# Altium project 屏幕一体板v3.PrjPcb
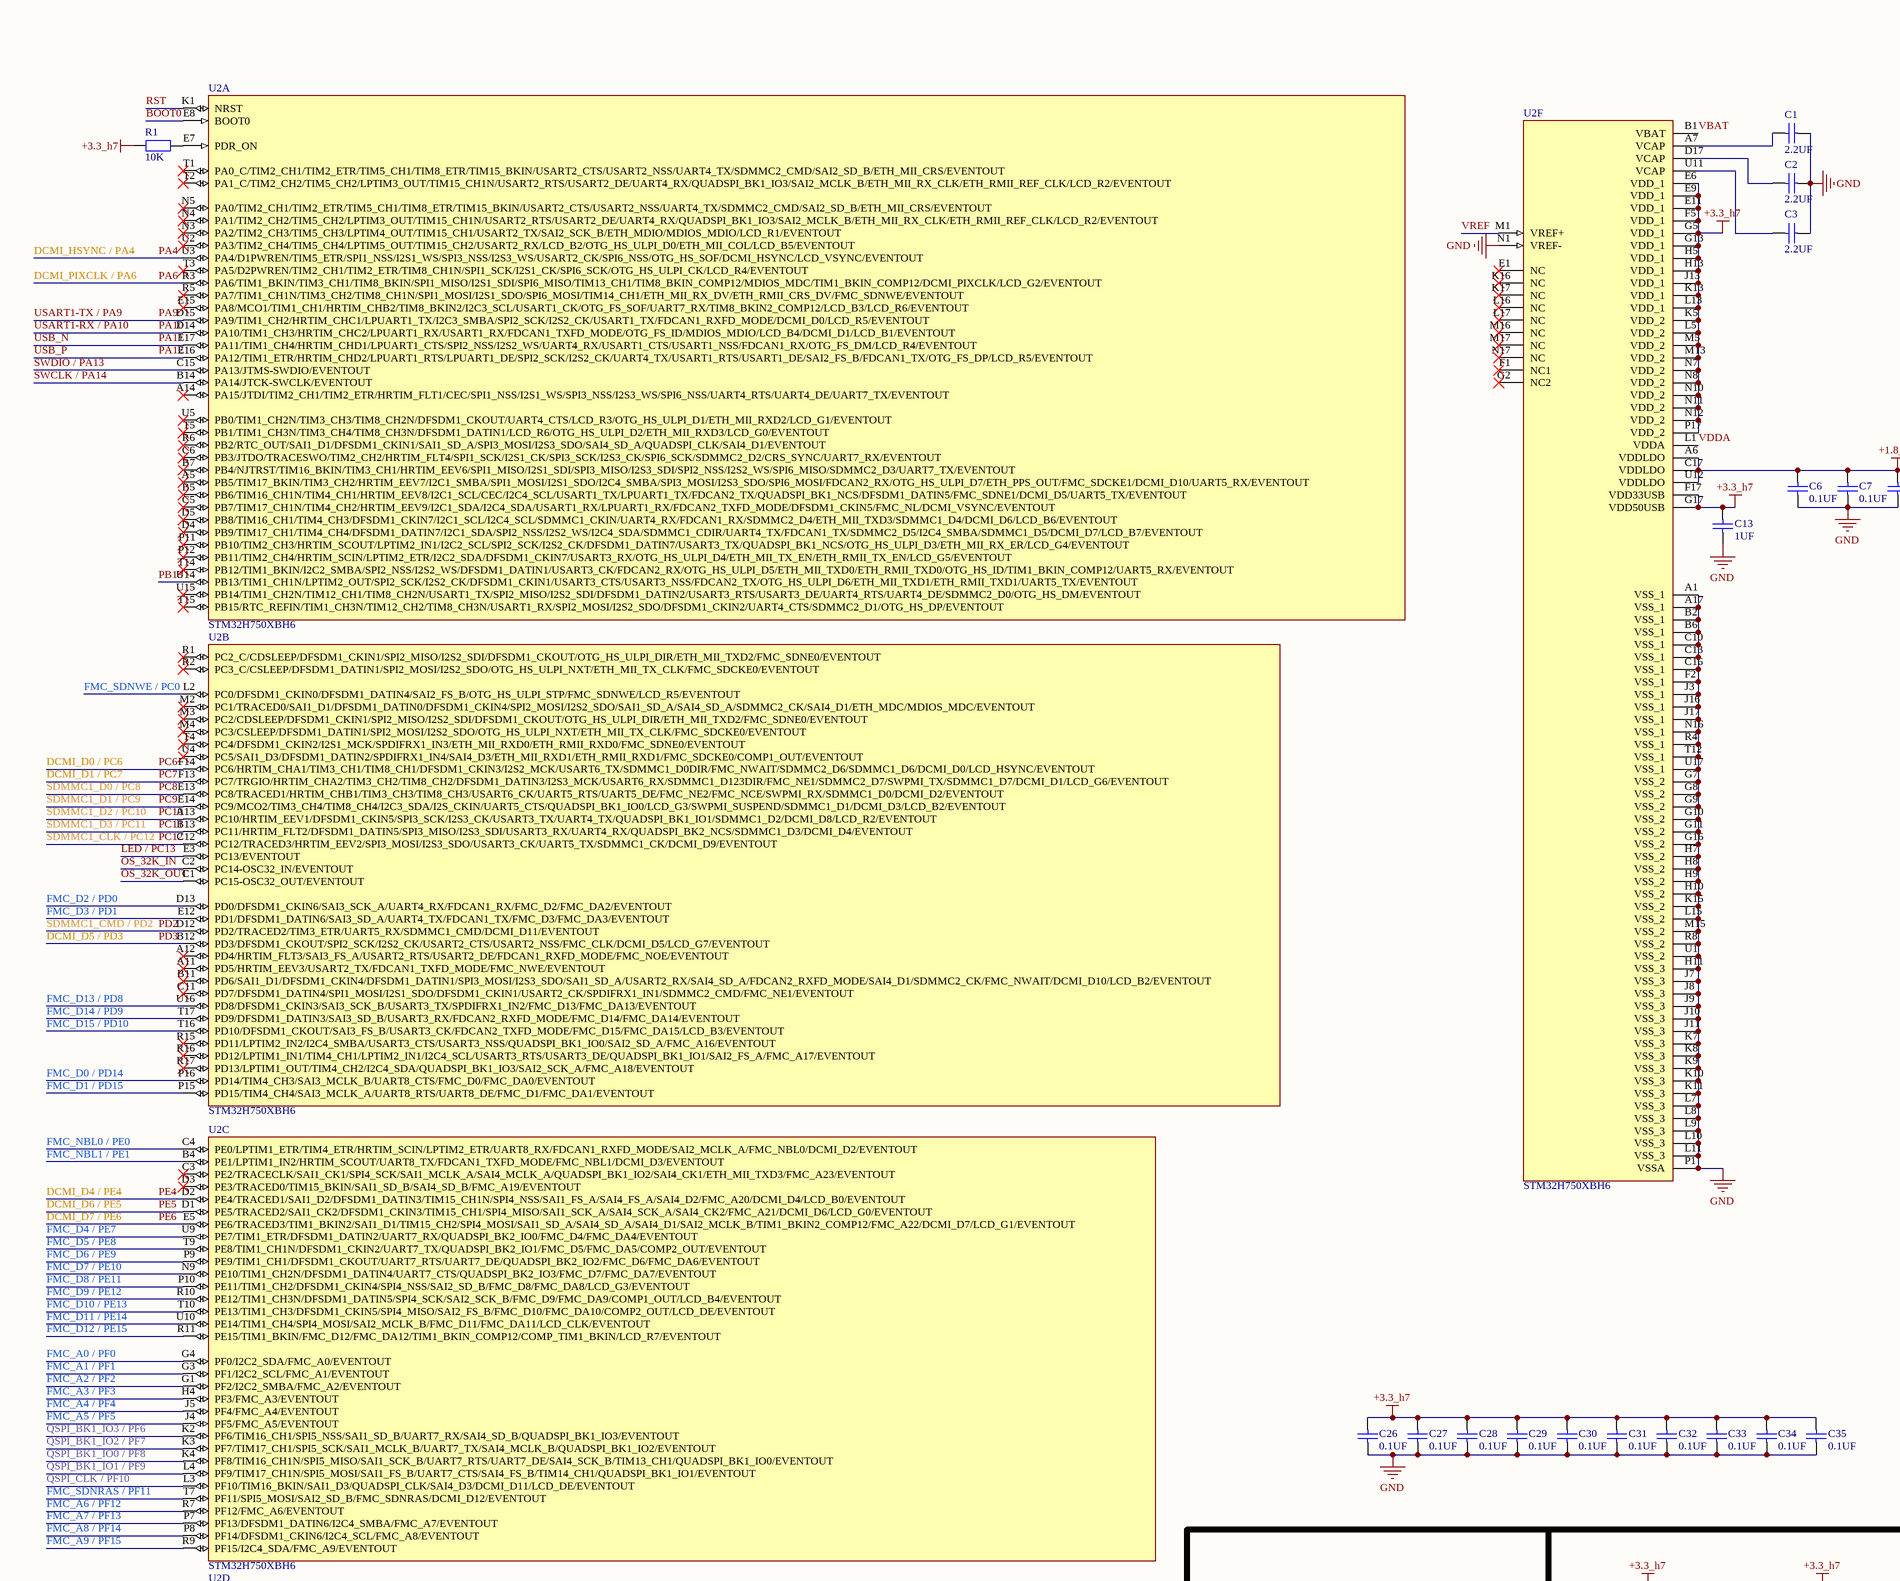
[diagram p0: Sheet1.SchDoc, top left]
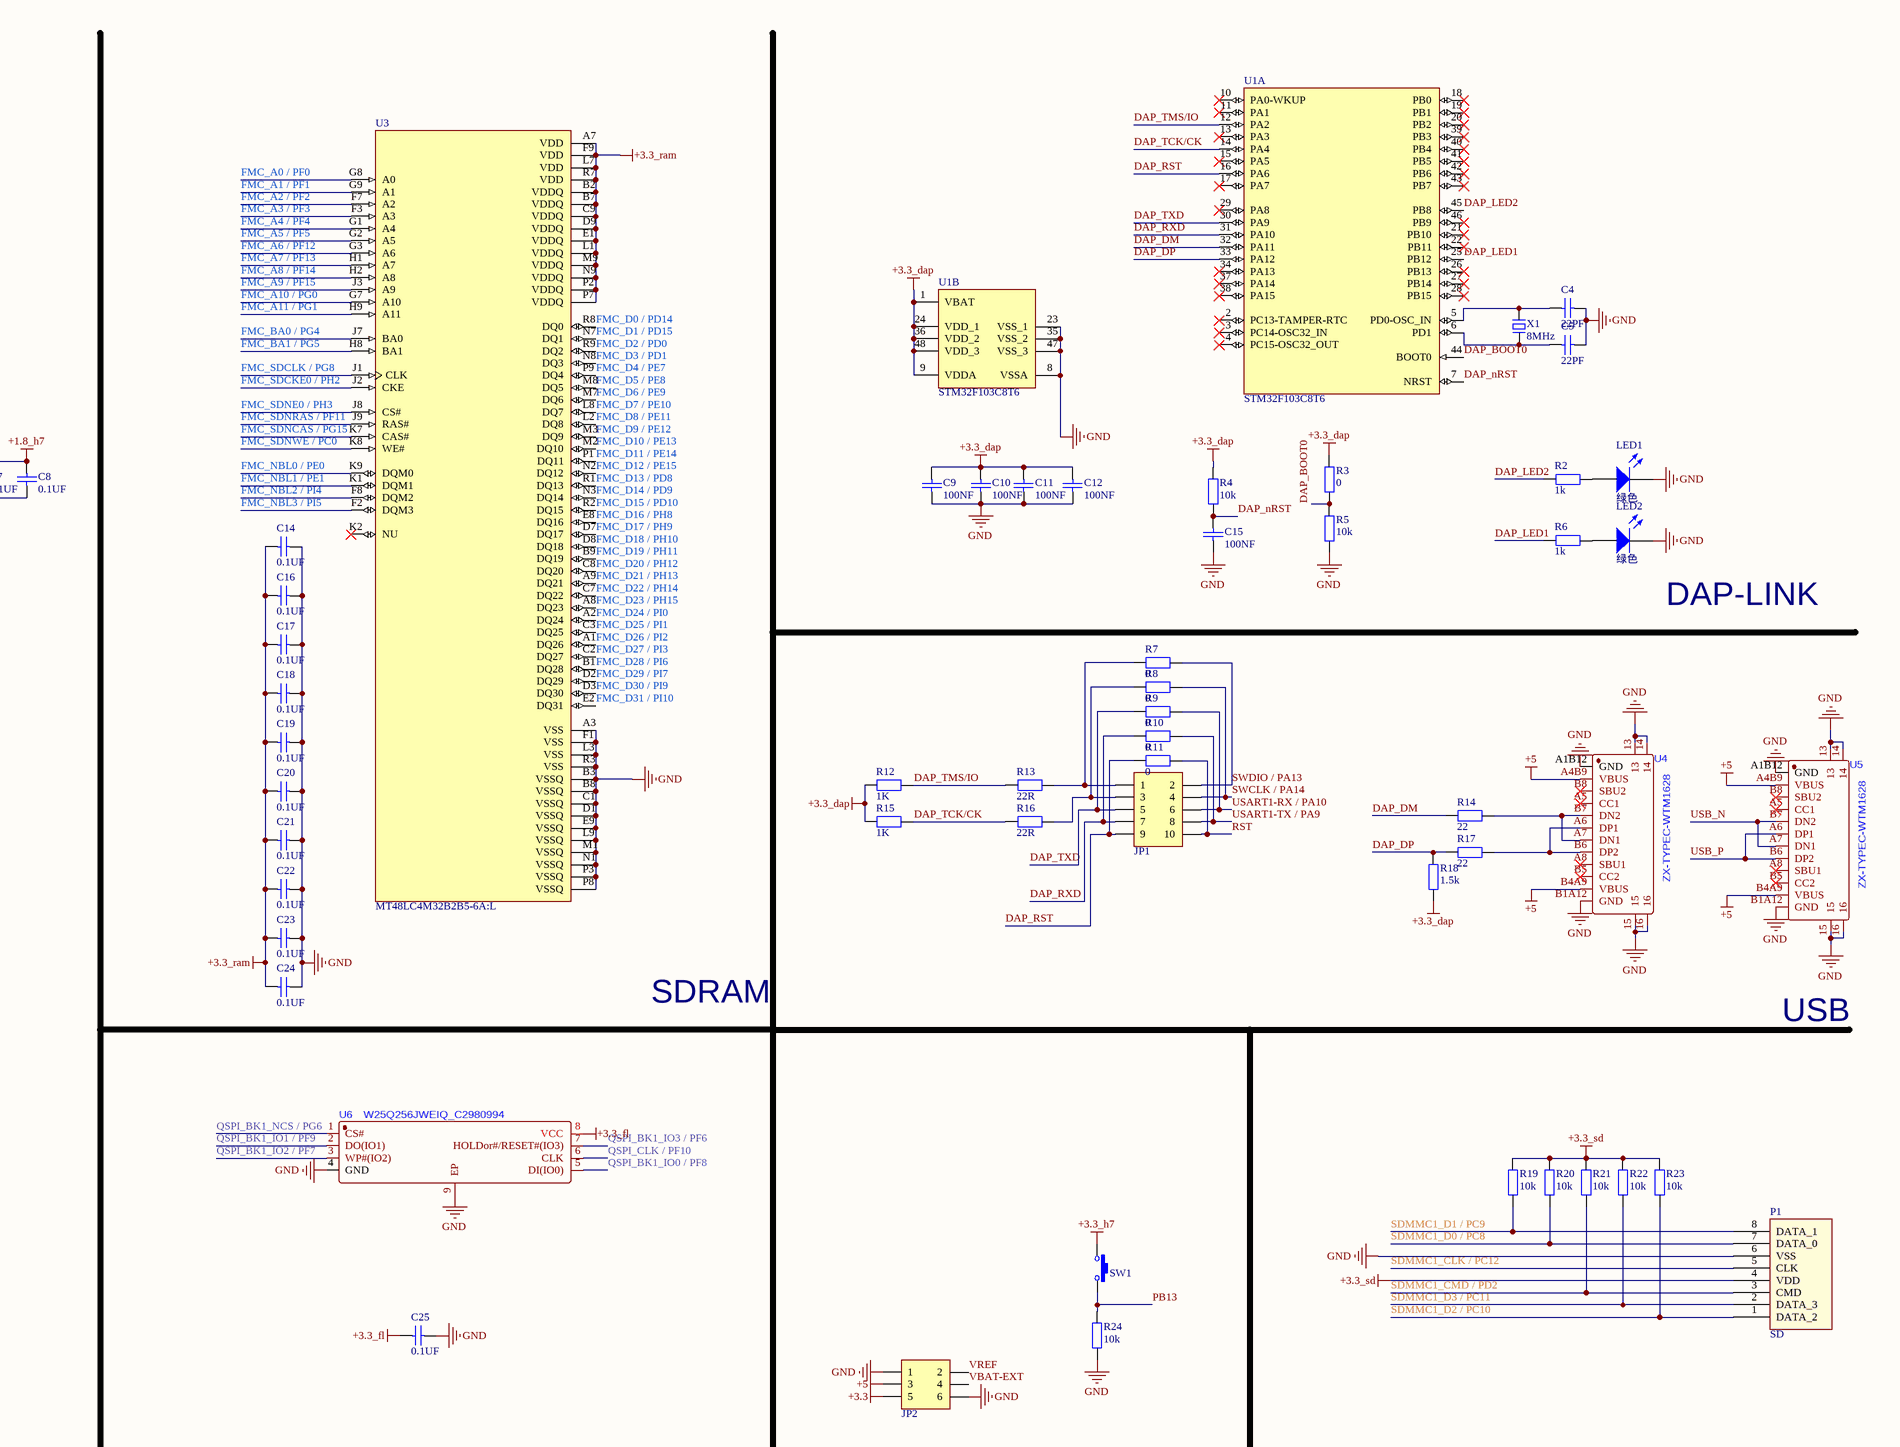
[diagram p1: Sheet1.SchDoc, top right]
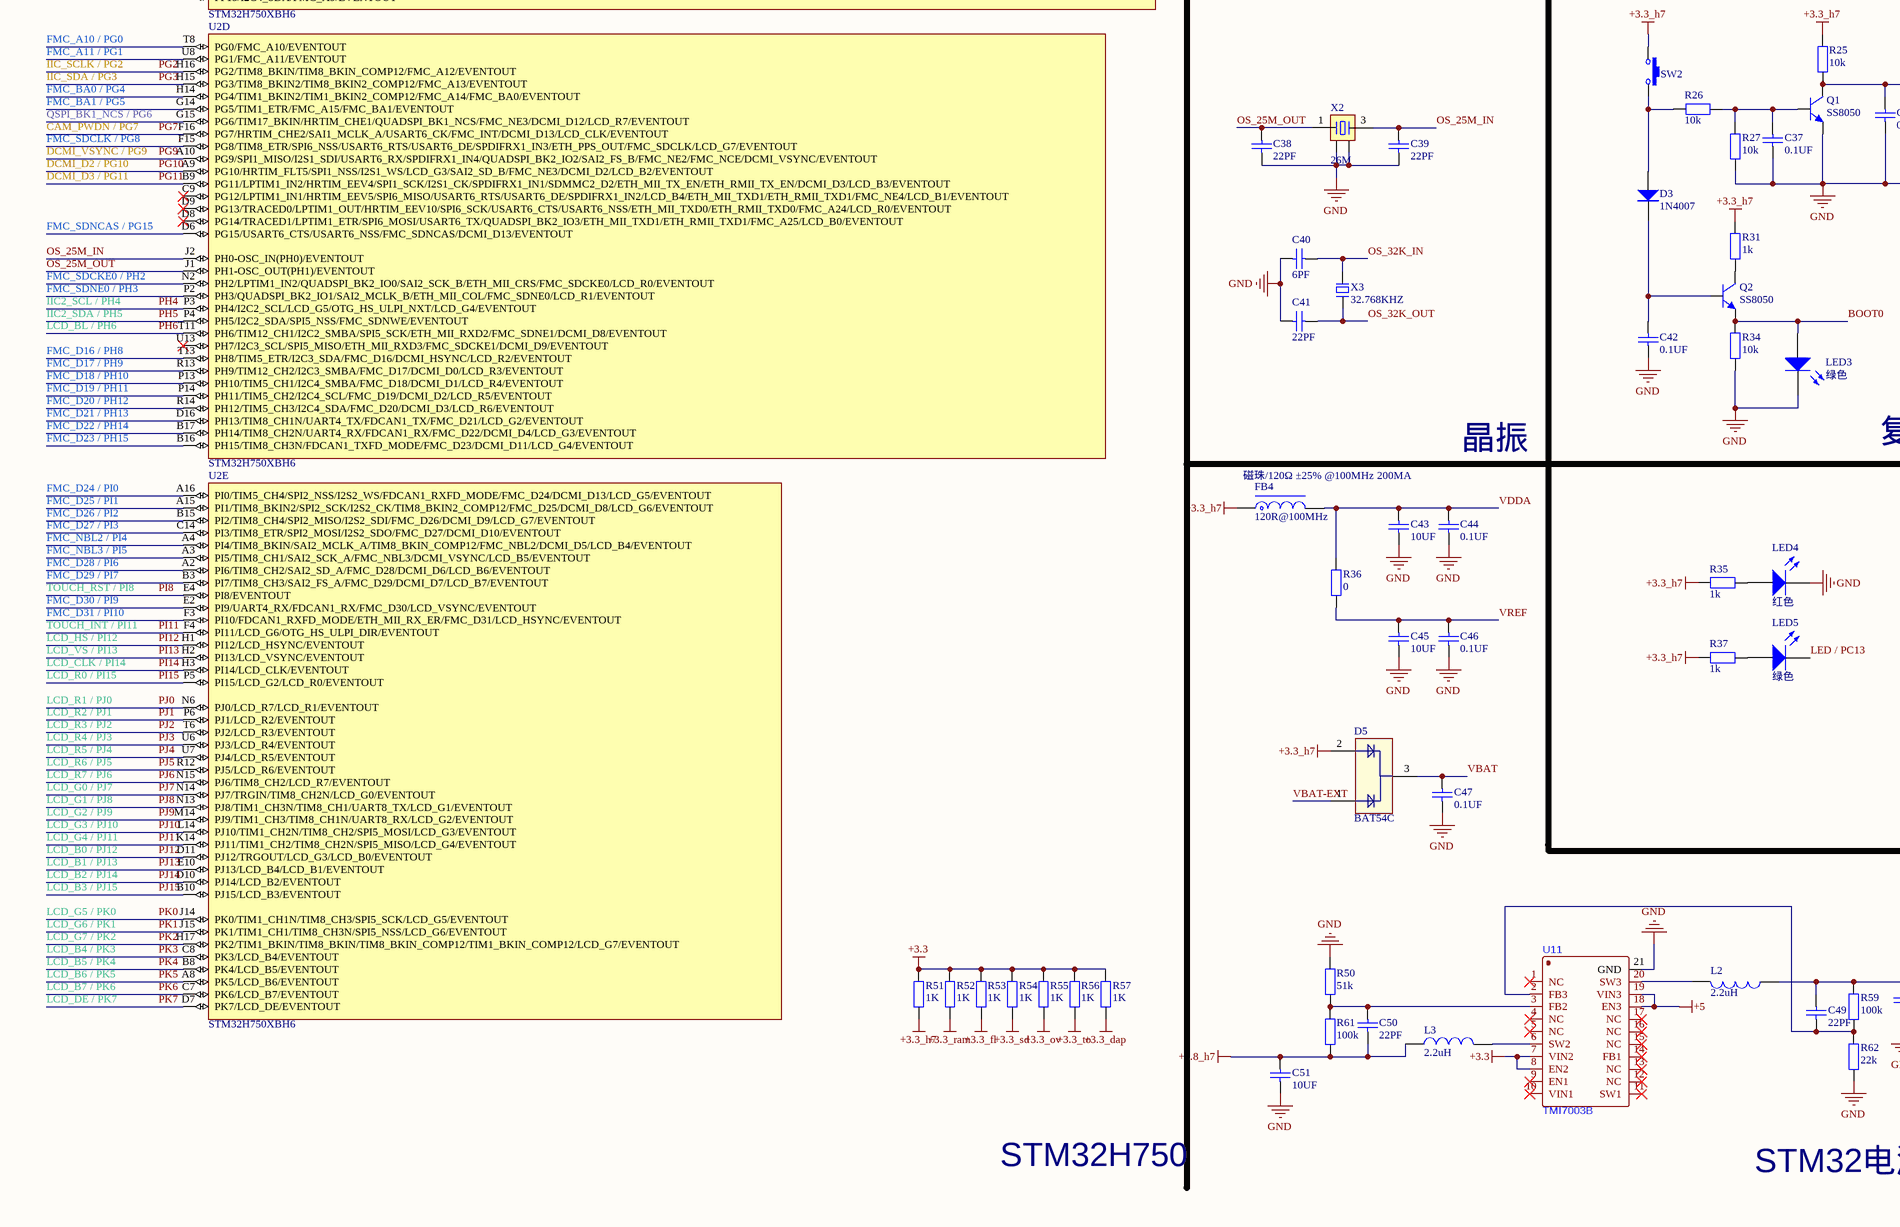
[diagram p2: Sheet1.SchDoc, bottom left]
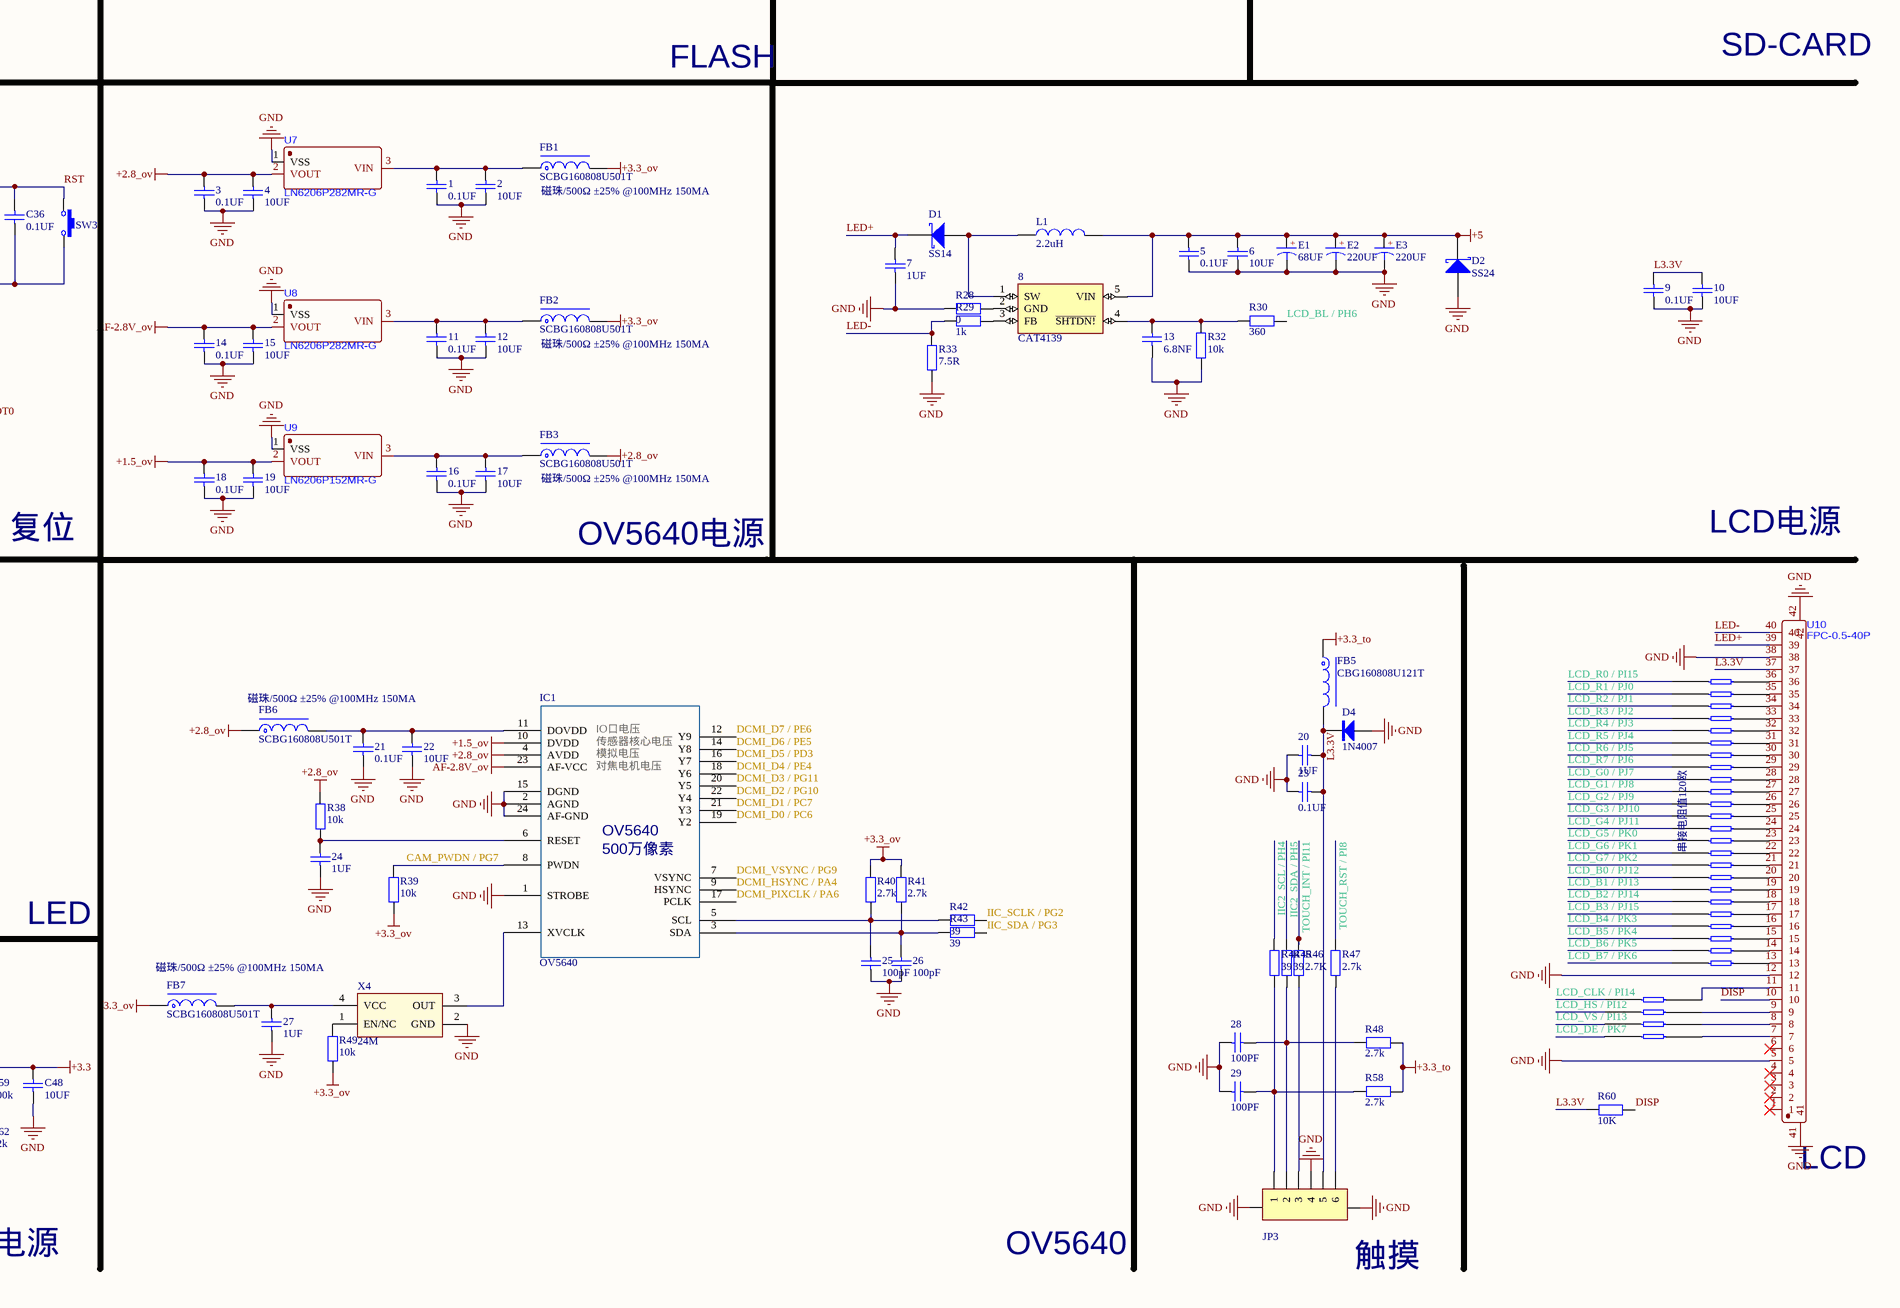
[diagram p3: Sheet1.SchDoc, bottom right]
1 sheet, 197 parts. Net scope: global (net labels, ports and power ports of the same name join across sheets).
Board file: PCB1.PcbDoc

## Sheet Sheet1.SchDoc
size A1; SheetNumber: 1; SheetTotal: 1

### Parts
1  0.1UF  [C0603_L]
2  10UF  [C0603_L]
3  0.1UF  [C0603_L]
4  10UF  [C0603_L]
5  0.1UF  [C0603_L]
6  10UF  [C0603_L]
7  1UF  [C0603_L]
8  CAT4139  [SOT-23(OT)5_LEAD]
9  0.1UF  [C0603_L]
10  10UF  [C0603_L]
11  0.1UF  [C0603_L]
12  10UF  [C0603_L]
13  6.8NF  [C0603_L]
14  0.1UF  [C0603_L]
15  10UF  [C0603_L]
16  0.1UF  [C0603_L]
17  10UF  [C0603_L]
18  0.1UF  [C0603_L]
19  10UF  [C0603_L]
20  1UF  [C0603_L]
21  0.1UF  [C0603_L]
22  10UF  [C0603_L]
23  0.1UF  [C0603_L]
24  1UF  [C0603_L]
25  100pF  [C0603_L]
26  100pF  [C0603_L]
27  1UF  [C0603_L]
28  100PF  [C0603_L]
29  100PF  [C0603_L]
C1  2.2UF  [C0603_L]
C2  2.2UF  [C0603_L]
C3  2.2UF  [C0603_L]
C4  22PF  [C0603_L]
C5  22PF  [C0603_L]
C6  0.1UF  [C0603_L]
C7  0.1UF  [C0603_L]
C8  0.1UF  [C0603_L]
C9  100NF  [C0603_L]
C10  100NF  [C0603_L]
C11  100NF  [C0603_L]
C12  100NF  [C0603_L]
C13  1UF  [C0603_L]
C14  0.1UF  [C0402_M]
C15  100NF  [C0603_L]
C16  0.1UF  [C0402_M]
C17  0.1UF  [C0402_M]
C18  0.1UF  [C0402_M]
C19  0.1UF  [C0402_M]
C20  0.1UF  [C0402_M]
C21  0.1UF  [C0402_M]
C22  0.1UF  [C0402_M]
C23  0.1UF  [C0402_M]
C24  0.1UF  [C0402_M]
C25  0.1UF  [C0603_L]
C26  0.1UF  [C0402_M]
C27  0.1UF  [C0402_M]
C28  0.1UF  [C0603_L]
C29  0.1UF  [C0402_M]
C30  0.1UF  [C0402_M]
C31  0.1UF  [C0402_M]
C32  0.1UF  [C0402_M]
C33  0.1UF  [C0402_M]
C34  0.1UF  [C0402_M]
C35  0.1UF  [C0402_M]
C36  0.1UF  [C0603_L]
C37  0.1UF  [C0603_L]
C38  22PF  [C0603_L]
C39  22PF  [C0603_L]
C40  6PF  [C0603_L]
C41  22PF  [C0603_L]
C42  0.1UF  [C0603_L]
C43  10UF  [C0603_L]
C44  0.1UF  [C0603_L]
C45  10UF  [C0603_L]
C46  0.1UF  [C0603_L]
C47  0.1UF  [C0603_L]
C48  10UF  [C0603_L]
C49  22PF  [C0603_L]
C50  22PF  [C0603_L]
C51  10UF  [C0603_L]
D1  SS14  [SMA]
D2  SS24  [SMA]
D3  1N4007  [SMA]
D4  1N4007  [SMA]
D5  BAT54C  [SOT23-3N]
E1  68UF  [CE A(3*5.4)]
E2  220UF  [CE A(3*5.4)]
E3  220UF  [CE A(3*5.4)]
FB1  SCBG160808U501T  [FB0603]
FB2  SCBG160808U501T  [FB0603]
FB3  SCBG160808U501T  [FB0603]
FB4  120R@100MHz  [FB0603]
FB5  CBG160808U121T  [FB0805]
FB6  SCBG160808U501T  [FB0603]
FB7  SCBG160808U501T  [FB0603]
IC1  OV5640  [OV2640]
JP1  Header 5X2  [HDR2.54-M-LS-2x5P]  (value not drawn)
JP2  Header3X2  [HDR2.54-M-LS-2x3P]  (value not drawn)
JP3  CON-6P  [FPC0.5-WT-6P]  (value not drawn)
L1  2.2uH  [L0805]
L2  2.2uH  [L0805]
L3  2.2uH  [L0805]
LED1  绿色  [LED0805_G]
LED2  绿色  [LED0805_G]
LED3  绿色  [LED0805_G]
LED4  红色  [LED0603_R]
LED5  绿色  [LED0805_G]
P1  SD  [MICRO SD]
Q1  SS8050  [SOT23-3N]
Q2  SS8050  [SOT23-3N]
R1  10K  [R0603_L]
R2  1k  [R0603_L]
R3  0  [R0603_L]
R4  10k  [R0603_L]
R5  10k  [R0603_L]
R6  1k  [R0603_L]
R7  0  [R0603_L]
R8  0  [R0603_L]
R9  0  [R0603_L]
R10  0  [R0603_L]
R11  0  [R0603_L]
R12  1K  [R0805_L]
R13  22R  [R0805_L]
R14  22  [R0603_L]
R15  1K  [R0805_L]
R16  22R  [R0805_L]
R17  22  [R0603_L]
R18  1.5k  [R0603_L]
R19  10k  [R0603_L]
R20  10k  [R0603_L]
R21  10k  [R0603_L]
R22  10k  [R0603_L]
R23  10k  [R0603_L]
R24  10k  [R0603_L]
R25  10k  [R0603_L]
R26  10k  [R0603_L]
R27  10k  [R0603_L]
R28  0  [R0603_L]
R29  1k  [R0603_L]
R30  360  [R0603_L]
R31  1k  [R0603_L]
R32  10k  [R0603_L]
R33  7.5R  [R0603_L]
R34  10k  [R0603_L]
R35  1k  [R0603_L]
R36  0  [R0603_L]
R37  1k  [R0603_L]
R38  10k  [R0603_L]
R39  10k  [R0603_L]
R40  2.7k  [R0603_L]
R41  2.7k  [R0603_L]
R42  39  [R0603_L]
R43  39  [R0603_L]
R44  39  [R0603_L]
R45  39  [R0603_L]
R46  2.7K  [R0603_L]
R47  2.7k  [R0603_L]
R48  2.7k  [R0603_L]
R49  10k  [R0603_L]
R50  51k  [R0603_L]
R51  1K  [R0805_L]
R52  1K  [R0805_L]
R53  1K  [R0805_L]
R54  1K  [R0805_L]
R55  1K  [R0805_L]
R56  1K  [R0805_L]
R57  1K  [R0805_L]
R58  2.7k  [R0603_L]
R59  100k  [R0603_L]
R60  10K  [R0603_L]
R61  100k  [R0603_L]
R62  22k  [R0603_L]
RP1  120R排阻  [0603_4P]  (value not drawn)
RP2  120R排阻  [0603_4P]  (value not drawn)
RP3  120R排阻  [0603_4P]  (value not drawn)
RP4  120R排阻  [0603_4P]  (value not drawn)
RP5  120R排阻  [0603_4P]  (value not drawn)
RP6  120R排阻  [0603_4P]  (value not drawn)
RP7  120R排阻  [0603_4P]  (value not drawn)
SW1  3x6x5  [SW SMD-3*6*2.5]  (value not drawn)
SW2  3x6x5  [SW SMD-3*6*2.5]  (value not drawn)
SW3  3x6x5  [SW SMD-3*6*2.5]  (value not drawn)
U1  STM32F103C8T6  [LQFP48_N]  (parts A,B of 2)
U2  STM32H750XBH6  [IC_STM32H750XBH6]  (parts A,B,C,D,E,F of 6)
U3  MT48LC4M32B2B5-6A:L  [BGA90C80P9X15_800X1300X100N]
U4  ZX-TYPEC-WTM1628  [USB-C-SMD_ZX-TYPEC-WTM1628]
U5  ZX-TYPEC-WTM1628  [USB-C-SMD_ZX-TYPEC-WTM1628]
U6  W25Q256JWEIQ_C2980994  [WSON-8_L8.0-W6.0-P1.27-TL-EP-1]
U7  LN6206P282MR-G  [SOT-23-3_L2.9-W1.3-P1.90-LS2.4-BR]
U8  LN6206P282MR-G  [SOT-23-3_L2.9-W1.3-P1.90-LS2.4-BR]
U9  LN6206P152MR-G  [SOT-23-3_L2.9-W1.3-P1.90-LS2.4-BR]
U10  FPC-0.5-40P  [CONN-SMD_FPC-0.5-40P]
U11  TMI7003B  [QFN-20_L3.0-W3.0-P0.40-BL-EP1.7]
X1  8MHz  [XTAL-3215-2P]
X2  26M  [XTAL-3225-4P]
X3  32.768KHZ  [XTAL-3215-2P]
X4  24M  [OSC-3225-4P]

### Nets
+1.5_ov: 18.2 19.2 IC1.10(DVDD) U9.2(VOUT)
+1.8_h7: C6.1 C7.1 C8.1 C50.2 C51.1 L3.1 R61.1 U2.A6(VDDLDO) U2.C17(VDDLDO) U2.U12(VDDLDO)
+2.8_ov: 3.2 4.2 FB3.2 FB6.1 IC1.4(AVDD) R38.1 U7.2(VOUT)
+3.3: C48.2 C49.2 JP2.5 L2.1 R51.2 R52.2 R53.2 R54.2 R55.2 R56.2 R57.2 R59.1 U11.7(VIN2) U11.8(EN2)
+3.3_dap: C9.2 C10.2 C11.2 C12.2 R3.2 R4.2 R12.1 R15.1 R18.1 R57.1 U1.1(VBAT) U1.9(VDDA) U1.24(VDD_1) U1.36(VDD_2) U1.48(VDD_3)
+3.3_fl: C25.2 R53.1 U6.8(VCC)
+3.3_h7: C13.2 C26.2 C27.2 C28.2 C29.2 C30.2 C31.2 C32.2 C33.2 C34.2 C35.2 D5.2 FB4.1 R1.1 R25.2 R31.2 R35.1 R37.1 R51.1 SW1.1 SW2.1 U2.E6(VDD_1) U2.E9(VDD_1) U2.E11(VDD_1) U2.F5(VDD_1) U2.F17(VDD33USB) U2.G5(VDD_1) U2.G13(VDD_1) U2.G17(VDD50USB) U2.H5(VDD_1) U2.H13(VDD_1) U2.J13(VDD_1) U2.K5(VDD_2) U2.K13(VDD_1) U2.L5(VDD_2) U2.L13(VDD_1) U2.M5(VDD_2) U2.M13(VDD_2) U2.N7(VDD_2) U2.N8(VDD_2) U2.N10(VDD_2) U2.N11(VDD_2) U2.N12(VDD_2) U2.P17(VDD_2)
+3.3_ov: FB1.2 FB2.2 FB7.1 R39.2 R40.2 R41.2 R49.2 R55.1
+3.3_ram: C14.2 C16.2 C17.2 C18.2 C19.2 C20.2 C21.2 C22.2 C23.2 C24.2 R52.1 U3.A7(VDD) U3.B2(VDDQ) U3.B7(VDDQ) U3.C9(VDDQ) U3.D9(VDDQ) U3.E1(VDDQ) U3.F9(VDD) U3.L1(VDDQ) U3.L7(VDD) U3.M9(VDDQ) U3.N9(VDDQ) U3.P2(VDDQ) U3.P7(VDDQ) U3.R7(VDD)
+3.3_sd: P1.4(VDD) R19.1 R20.1 R21.1 R22.1 R23.1 R54.1
+3.3_to: FB5.1 R48.2 R56.1 R58.2
+5: 5.2 6.2 8.5(VIN) D2.2(K) E1.1 E2.1 E3.1 JP2.3 L1.2 U4.A4B9(VBUS) U4.B4A9(VBUS) U5.A4B9(VBUS) U5.B4A9(VBUS) U11.18(EN3) U11.19(VIN3)
AF-2.8V_ov: 14.2 15.2 IC1.23(AF-VCC) U8.2(VOUT)
GND: 1.1 2.1 3.1 4.1 5.1 6.1 7.1 9.1 10.1 11.1 12.1 13.1 14.1 15.1 16.1 17.1 18.1 19.1 20.1 21.1 22.1 23.1 24.1 25.1 26.1 27.1 28.1 29.1 C1.1 C2.1 C3.1 C4.2 C5.2 C6.2 C7.2 C8.2 C9.1 C10.1 C11.1 C12.1 C13.1 C14.1 C15.1 C16.1 C17.1 C18.1 C19.1 C20.1 C21.1 C22.1 C23.1 C24.1 C25.1 C26.1 C27.1 C28.1 C29.1 C30.1 C31.1 C32.1 C33.1 C34.1 C35.1 C36.2 C37.2 C38.1 C39.1 C40.2 C41.2 C42.2 C43.1 C44.1 C45.1 C46.1 C47.2 C48.1 C51.2 D2.1(A) D4.1(A) E1.2 E2.2 E3.2 IC1.1(STROBE) IC1.2(AGND) IC1.15(DGND) IC1.24(AF-GND) JP2.1 JP2.6 JP3.0 JP3.4 LED1.2(K) LED2.2(K) LED3.2(K) LED4.2(K) P1.6(VSS) Q1.2(E) R5.1 R24.1 R27.1 R28.1 R32.2 R33.2 R34.1 R50.2 R62.2 SW3.2 U1.8(VSSA) U1.23(VSS_1) U1.35(VSS_2) U1.47(VSS_3) U2.A1(VSS_1) U2.A17(VSS_1) U2.B2(VSS_1) U2.B6(VSS_1) U2.C10(VSS_1) U2.C13(VSS_1) U2.C16(VSS_1) U2.F2(VSS_1) U2.G7(VSS_2) U2.G8(VSS_2) U2.G9(VSS_2) U2.G10(VSS_2) U2.G11(VSS_2) U2.G16(VSS_2) U2.H7(VSS_2) U2.H8(VSS_2) U2.H9(VSS_2) U2.H10(VSS_2) U2.H11(VSS_3) U2.J3(VSS_1) U2.J7(VSS_3) U2.J8(VSS_3) U2.J9(VSS_3) U2.J10(VSS_3) U2.J11(VSS_3) U2.J16(VSS_1) U2.J17(VSS_1) U2.K7(VSS_3) U2.K8(VSS_3) U2.K9(VSS_3) U2.K10(VSS_3) U2.K11(VSS_3) U2.K15(VSS_2) U2.L7(VSS_3) U2.L8(VSS_3) U2.L9(VSS_3) U2.L10(VSS_3) U2.L11(VSS_3) U2.L15(VSS_2) U2.M15(VSS_2) U2.N1(VREF-) U2.N16(VSS_1) U2.P1(VSSA) U2.R4(VSS_1) U2.R8(VSS_2) U2.T12(VSS_1) U2.U1(VSS_2) U2.U17(VSS_1) U3.A3(VSS) U3.B3(VSSQ) U3.B8(VSSQ) U3.C1(VSSQ) U3.D1(VSSQ) U3.E9(VSSQ) U3.F1(VSS) U3.L3(VSS) U3.L9(VSSQ) U3.M1(VSSQ) U3.N1(VSSQ) U3.P3(VSSQ) U3.P8(VSSQ) U3.R3(VSS) U4.13 U4.14 U4.15 U4.16 U4.A1B12(GND) U4.B1A12(GND) U5.13 U5.14 U5.15 U5.16 U5.A1B12(GND) U5.B1A12(GND) U6.4(GND) U6.9(EP) U7.1(VSS) U8.1(VSS) U9.1(VSS) U10.5 U10.12 U10.38 U10.41 U10.42 U11.21(GND) X2.2 X2.4 X4.2(GND)
BOOT0: LED3.1(A) Q2.2(E) R34.2 U2.E8(BOOT0)
CAM_PWDN / PG7: IC1.8(PWDN) R39.1 U2.F16(PG7/HRTIM_CHE2/SAI1_MCLK_A/USART6_CK/FMC_INT/DCMI_D13/LCD_CLK/EVENTOUT)  [also labelled PG7]
DAP_BOOT0: R3.1 R5.2 U1.44(BOOT0)
DAP_DM: R14.1 U1.32(PA11)
DAP_DP: R17.1 R18.2 U1.33(PA12)
DAP_LED1: R6.1 U1.25(PB12)
DAP_LED2: R2.1 U1.45(PB8)
DAP_nRST: C15.2 R4.1 U1.7(NRST)
DAP_RST: JP1.9 R11.1 U1.16(PA6)
DAP_RXD: JP1.7 R10.1 U1.31(PA10)
DAP_TCK/CK: R15.2 R16.1 U1.14(PA4)
DAP_TMS/IO: R12.2 R13.1 U1.12(PA2)
DAP_TXD: JP1.5 R9.1 U1.30(PA9)
DCMI_D0 / PC6: IC1.19(Y2) U2.F14(PC6/HRTIM_CHA1/TIM3_CH1/TIM8_CH1/DFSDM1_CKIN3/I2S2_MCK/USART6_TX/SDMMC1_D0DIR/FMC_NWAIT/SDMMC2_D6/SDMMC1_D6/DCMI_D0/LCD_HSYNC/EVENTOUT)  [also labelled PC6]
DCMI_D1 / PC7: IC1.21(Y3) U2.F13(PC7/TRGIO/HRTIM_CHA2/TIM3_CH2/TIM8_CH2/DFSDM1_DATIN3/I2S3_MCK/USART6_RX/SDMMC1_D123DIR/FMC_NE1/SDMMC2_D7/SWPMI_TX/SDMMC1_D7/DCMI_D1/LCD_G6/EVENTOUT)  [also labelled PC7]
DCMI_D2 / PG10: IC1.22(Y4) U2.A9(PG10/HRTIM_FLT5/SPI1_NSS/I2S1_WS/LCD_G3/SAI2_SD_B/FMC_NE3/DCMI_D2/LCD_B2/EVENTOUT)  [also labelled PG10]
DCMI_D3 / PG11: IC1.20(Y5) U2.B9(PG11/LPTIM1_IN2/HRTIM_EEV4/SPI1_SCK/I2S1_CK/SPDIFRX1_IN1/SDMMC2_D2/ETH_MII_TX_EN/ETH_RMII_TX_EN/DCMI_D3/LCD_B3/EVENTOUT)  [also labelled PG11]
DCMI_D4 / PE4: IC1.18(Y6) U2.D2(PE4/TRACED1/SAI1_D2/DFSDM1_DATIN3/TIM15_CH1N/SPI4_NSS/SAI1_FS_A/SAI4_FS_A/SAI4_D2/FMC_A20/DCMI_D4/LCD_B0/EVENTOUT)  [also labelled PE4]
DCMI_D5 / PD3: IC1.16(Y7) U2.B12(PD3/DFSDM1_CKOUT/SPI2_SCK/I2S2_CK/USART2_CTS/USART2_NSS/FMC_CLK/DCMI_D5/LCD_G7/EVENTOUT)  [also labelled PD3]
DCMI_D6 / PE5: IC1.14(Y8) U2.D1(PE5/TRACED2/SAI1_CK2/DFSDM1_CKIN3/TIM15_CH1/SPI4_MISO/SAI1_SCK_A/SAI4_SCK_A/SAI4_CK2/FMC_A21/DCMI_D6/LCD_G0/EVENTOUT)  [also labelled PE5]
DCMI_D7 / PE6: IC1.12(Y9) U2.E5(PE6/TRACED3/TIM1_BKIN2/SAI1_D1/TIM15_CH2/SPI4_MOSI/SAI1_SD_A/SAI4_SD_A/SAI4_D1/SAI2_MCLK_B/TIM1_BKIN2_COMP12/FMC_A22/DCMI_D7/LCD_G1/EVENTOUT)  [also labelled PE6]
DCMI_HSYNC / PA4: IC1.9(HSYNC) U2.U3(PA4/D1PWREN/TIM5_ETR/SPI1_NSS/I2S1_WS/SPI3_NSS/I2S3_WS/USART2_CK/SPI6_NSS/OTG_HS_SOF/DCMI_HSYNC/LCD_VSYNC/EVENTOUT)  [also labelled PA4]
DCMI_PIXCLK / PA6: IC1.17(PCLK) U2.R3(PA6/TIM1_BKIN/TIM3_CH1/TIM8_BKIN/SPI1_MISO/I2S1_SDI/SPI6_MISO/TIM13_CH1/TIM8_BKIN_COMP12/MDIOS_MDC/TIM1_BKIN_COMP12/DCMI_PIXCLK/LCD_G2/EVENTOUT)  [also labelled PA6]
DCMI_VSYNC / PG9: IC1.7(VSYNC) U2.A10(PG9/SPI1_MISO/I2S1_SDI/USART6_RX/SPDIFRX1_IN4/QUADSPI_BK2_IO2/SAI2_FS_B/FMC_NE2/FMC_NCE/DCMI_VSYNC/EVENTOUT)  [also labelled PG9]
DISP: R60.2 U10.10
FMC_A0 / PF0: U2.G4(PF0/I2C2_SDA/FMC_A0/EVENTOUT) U3.G8(A0)
FMC_A1 / PF1: U2.G3(PF1/I2C2_SCL/FMC_A1/EVENTOUT) U3.G9(A1)
FMC_A2 / PF2: U2.G1(PF2/I2C2_SMBA/FMC_A2/EVENTOUT) U3.F7(A2)
FMC_A3 / PF3: U2.H4(PF3/FMC_A3/EVENTOUT) U3.F3(A3)
FMC_A4 / PF4: U2.J5(PF4/FMC_A4/EVENTOUT) U3.G1(A4)
FMC_A5 / PF5: U2.J4(PF5/FMC_A5/EVENTOUT) U3.G2(A5)
FMC_A6 / PF12: U2.R7(PF12/FMC_A6/EVENTOUT) U3.G3(A6)
FMC_A7 / PF13: U2.P7(PF13/DFSDM1_DATIN6/I2C4_SMBA/FMC_A7/EVENTOUT) U3.H1(A7)
FMC_A8 / PF14: U2.P8(PF14/DFSDM1_CKIN6/I2C4_SCL/FMC_A8/EVENTOUT) U3.H2(A8)
FMC_A9 / PF15: U2.R9(PF15/I2C4_SDA/FMC_A9/EVENTOUT) U3.J3(A9)
FMC_A10 / PG0: U2.T8(PG0/FMC_A10/EVENTOUT) U3.G7(A10)
FMC_A11 / PG1: U2.U8(PG1/FMC_A11/EVENTOUT) U3.H9(A11)
FMC_BA0 / PG4: U2.H14(PG4/TIM1_BKIN2/TIM1_BKIN2_COMP12/FMC_A14/FMC_BA0/EVENTOUT) U3.J7(BA0)
FMC_BA1 / PG5: U2.G14(PG5/TIM1_ETR/FMC_A15/FMC_BA1/EVENTOUT) U3.H8(BA1)
FMC_D0 / PD14: U2.P16(PD14/TIM4_CH3/SAI3_MCLK_B/UART8_CTS/FMC_D0/FMC_DA0/EVENTOUT) U3.R8(DQ0)
FMC_D1 / PD15: U2.P15(PD15/TIM4_CH4/SAI3_MCLK_A/UART8_RTS/UART8_DE/FMC_D1/FMC_DA1/EVENTOUT) U3.N7(DQ1)
FMC_D2 / PD0: U2.D13(PD0/DFSDM1_CKIN6/SAI3_SCK_A/UART4_RX/FDCAN1_RX/FMC_D2/FMC_DA2/EVENTOUT) U3.R9(DQ2)
FMC_D3 / PD1: U2.E12(PD1/DFSDM1_DATIN6/SAI3_SD_A/UART4_TX/FDCAN1_TX/FMC_D3/FMC_DA3/EVENTOUT) U3.N8(DQ3)
FMC_D4 / PE7: U2.U9(PE7/TIM1_ETR/DFSDM1_DATIN2/UART7_RX/QUADSPI_BK2_IO0/FMC_D4/FMC_DA4/EVENTOUT) U3.P9(DQ4)
FMC_D5 / PE8: U2.T9(PE8/TIM1_CH1N/DFSDM1_CKIN2/UART7_TX/QUADSPI_BK2_IO1/FMC_D5/FMC_DA5/COMP2_OUT/EVENTOUT) U3.M8(DQ5)
FMC_D6 / PE9: U2.P9(PE9/TIM1_CH1/DFSDM1_CKOUT/UART7_RTS/UART7_DE/QUADSPI_BK2_IO2/FMC_D6/FMC_DA6/EVENTOUT) U3.M7(DQ6)
FMC_D7 / PE10: U2.N9(PE10/TIM1_CH2N/DFSDM1_DATIN4/UART7_CTS/QUADSPI_BK2_IO3/FMC_D7/FMC_DA7/EVENTOUT) U3.L8(DQ7)
FMC_D8 / PE11: U2.P10(PE11/TIM1_CH2/DFSDM1_CKIN4/SPI4_NSS/SAI2_SD_B/FMC_D8/FMC_DA8/LCD_G3/EVENTOUT) U3.L2(DQ8)
FMC_D9 / PE12: U2.R10(PE12/TIM1_CH3N/DFSDM1_DATIN5/SPI4_SCK/SAI2_SCK_B/FMC_D9/FMC_DA9/COMP1_OUT/LCD_B4/EVENTOUT) U3.M3(DQ9)
FMC_D10 / PE13: U2.T10(PE13/TIM1_CH3/DFSDM1_CKIN5/SPI4_MISO/SAI2_FS_B/FMC_D10/FMC_DA10/COMP2_OUT/LCD_DE/EVENTOUT) U3.M2(DQ10)
FMC_D11 / PE14: U2.U10(PE14/TIM1_CH4/SPI4_MOSI/SAI2_MCLK_B/FMC_D11/FMC_DA11/LCD_CLK/EVENTOUT) U3.P1(DQ11)
FMC_D12 / PE15: U2.R11(PE15/TIM1_BKIN/FMC_D12/FMC_DA12/TIM1_BKIN_COMP12/COMP_TIM1_BKIN/LCD_R7/EVENTOUT) U3.N2(DQ12)
FMC_D13 / PD8: U2.U16(PD8/DFSDM1_CKIN3/SAI3_SCK_B/USART3_TX/SPDIFRX1_IN2/FMC_D13/FMC_DA13/EVENTOUT) U3.R1(DQ13)
FMC_D14 / PD9: U2.T17(PD9/DFSDM1_DATIN3/SAI3_SD_B/USART3_RX/FDCAN2_RXFD_MODE/FMC_D14/FMC_DA14/EVENTOUT) U3.N3(DQ14)
FMC_D15 / PD10: U2.T16(PD10/DFSDM1_CKOUT/SAI3_FS_B/USART3_CK/FDCAN2_TXFD_MODE/FMC_D15/FMC_DA15/LCD_B3/EVENTOUT) U3.R2(DQ15)
FMC_D16 / PH8: U2.T13(PH8/TIM5_ETR/I2C3_SDA/FMC_D16/DCMI_HSYNC/LCD_R2/EVENTOUT) U3.E8(DQ16)
FMC_D17 / PH9: U2.R13(PH9/TIM12_CH2/I2C3_SMBA/FMC_D17/DCMI_D0/LCD_R3/EVENTOUT) U3.D7(DQ17)
FMC_D18 / PH10: U2.P13(PH10/TIM5_CH1/I2C4_SMBA/FMC_D18/DCMI_D1/LCD_R4/EVENTOUT) U3.D8(DQ18)
FMC_D19 / PH11: U2.P14(PH11/TIM5_CH2/I2C4_SCL/FMC_D19/DCMI_D2/LCD_R5/EVENTOUT) U3.B9(DQ19)
FMC_D20 / PH12: U2.R14(PH12/TIM5_CH3/I2C4_SDA/FMC_D20/DCMI_D3/LCD_R6/EVENTOUT) U3.C8(DQ20)
FMC_D21 / PH13: U2.D16(PH13/TIM8_CH1N/UART4_TX/FDCAN1_TX/FMC_D21/LCD_G2/EVENTOUT) U3.A9(DQ21)
FMC_D22 / PH14: U2.B17(PH14/TIM8_CH2N/UART4_RX/FDCAN1_RX/FMC_D22/DCMI_D4/LCD_G3/EVENTOUT) U3.C7(DQ22)
FMC_D23 / PH15: U2.B16(PH15/TIM8_CH3N/FDCAN1_TXFD_MODE/FMC_D23/DCMI_D11/LCD_G4/EVENTOUT) U3.A8(DQ23)
FMC_D24 / PI0: U2.A16(PI0/TIM5_CH4/SPI2_NSS/I2S2_WS/FDCAN1_RXFD_MODE/FMC_D24/DCMI_D13/LCD_G5/EVENTOUT) U3.A2(DQ24)
FMC_D25 / PI1: U2.A15(PI1/TIM8_BKIN2/SPI2_SCK/I2S2_CK/TIM8_BKIN2_COMP12/FMC_D25/DCMI_D8/LCD_G6/EVENTOUT) U3.C3(DQ25)
FMC_D26 / PI2: U2.B15(PI2/TIM8_CH4/SPI2_MISO/I2S2_SDI/FMC_D26/DCMI_D9/LCD_G7/EVENTOUT) U3.A1(DQ26)
FMC_D27 / PI3: U2.C14(PI3/TIM8_ETR/SPI2_MOSI/I2S2_SDO/FMC_D27/DCMI_D10/EVENTOUT) U3.C2(DQ27)
FMC_D28 / PI6: U2.A2(PI6/TIM8_CH2/SAI2_SD_A/FMC_D28/DCMI_D6/LCD_B6/EVENTOUT) U3.B1(DQ28)
FMC_D29 / PI7: U2.B3(PI7/TIM8_CH3/SAI2_FS_A/FMC_D29/DCMI_D7/LCD_B7/EVENTOUT) U3.D2(DQ29)
FMC_D30 / PI9: U2.E2(PI9/UART4_RX/FDCAN1_RX/FMC_D30/LCD_VSYNC/EVENTOUT) U3.D3(DQ30)
FMC_D31 / PI10: U2.F3(PI10/FDCAN1_RXFD_MODE/ETH_MII_RX_ER/FMC_D31/LCD_HSYNC/EVENTOUT) U3.E2(DQ31)
FMC_NBL0 / PE0: U2.C4(PE0/LPTIM1_ETR/TIM4_ETR/HRTIM_SCIN/LPTIM2_ETR/UART8_RX/FDCAN1_RXFD_MODE/SAI2_MCLK_A/FMC_NBL0/DCMI_D2/EVENTOUT) U3.K9(DQM0)
FMC_NBL1 / PE1: U2.B4(PE1/LPTIM1_IN2/HRTIM_SCOUT/UART8_TX/FDCAN1_TXFD_MODE/FMC_NBL1/DCMI_D3/EVENTOUT) U3.K1(DQM1)
FMC_NBL2 / PI4: U2.A4(PI4/TIM8_BKIN/SAI2_MCLK_A/TIM8_BKIN_COMP12/FMC_NBL2/DCMI_D5/LCD_B4/EVENTOUT) U3.F8(DQM2)
FMC_NBL3 / PI5: U2.A3(PI5/TIM8_CH1/SAI2_SCK_A/FMC_NBL3/DCMI_VSYNC/LCD_B5/EVENTOUT) U3.F2(DQM3)
FMC_SDCKE0 / PH2: U2.N2(PH2/LPTIM1_IN2/QUADSPI_BK2_IO0/SAI2_SCK_B/ETH_MII_CRS/FMC_SDCKE0/LCD_R0/EVENTOUT) U3.J2(CKE)
FMC_SDCLK / PG8: U2.F15(PG8/TIM8_ETR/SPI6_NSS/USART6_RTS/USART6_DE/SPDIFRX1_IN3/ETH_PPS_OUT/FMC_SDCLK/LCD_G7/EVENTOUT) U3.J1(CLK)
FMC_SDNCAS / PG15: U2.D6(PG15/USART6_CTS/USART6_NSS/FMC_SDNCAS/DCMI_D13/EVENTOUT) U3.K7(CAS#)
FMC_SDNE0 / PH3: U2.P2(PH3/QUADSPI_BK2_IO1/SAI2_MCLK_B/ETH_MII_COL/FMC_SDNE0/LCD_R1/EVENTOUT) U3.J8(CS#)
FMC_SDNRAS / PF11: U2.T7(PF11/SPI5_MOSI/SAI2_SD_B/FMC_SDNRAS/DCMI_D12/EVENTOUT) U3.J9(RAS#)
FMC_SDNWE / PC0: U2.L2(PC0/DFSDM1_CKIN0/DFSDM1_DATIN4/SAI2_FS_B/OTG_HS_ULPI_STP/FMC_SDNWE/LCD_R5/EVENTOUT) U3.K8(WE#)
IIC2_SCL / PH4: R44.1 U2.P3(PH4/I2C2_SCL/LCD_G5/OTG_HS_ULPI_NXT/LCD_G4/EVENTOUT)  [also labelled PH4]
IIC2_SDA / PH5: R45.1 U2.P4(PH5/I2C2_SDA/SPI5_NSS/FMC_SDNWE/EVENTOUT)  [also labelled PH5]
IIC_SCLK / PG2: R42.2 U2.H16(PG2/TIM8_BKIN/TIM8_BKIN_COMP12/FMC_A12/EVENTOUT)  [also labelled PG2]
IIC_SDA / PG3: R43.2 U2.H15(PG3/TIM8_BKIN2/TIM8_BKIN2_COMP12/FMC_A13/EVENTOUT)  [also labelled PG3]
L3.3V: 9.2 10.2 20.2 23.2 D4.2(K) FB5.2 JP3.5 R60.1 U10.37
LCD_B0 / PJ12: RP5.1 U2.D11(PJ12/TRGOUT/LCD_G3/LCD_B0/EVENTOUT)  [also labelled PJ12]
LCD_B1 / PJ13: RP5.2 U2.E10(PJ13/LCD_B4/LCD_B1/EVENTOUT)  [also labelled PJ13]
LCD_B2 / PJ14: RP5.3 U2.D10(PJ14/LCD_B2/EVENTOUT)  [also labelled PJ14]
LCD_B3 / PJ15: RP5.4 U2.B10(PJ15/LCD_B3/EVENTOUT)  [also labelled PJ15]
LCD_B4 / PK3: RP6.1 U2.C8(PK3/LCD_B4/EVENTOUT)  [also labelled PK3]
LCD_B5 / PK4: RP6.2 U2.B8(PK4/LCD_B5/EVENTOUT)  [also labelled PK4]
LCD_B6 / PK5: RP6.3 U2.A8(PK5/LCD_B6/EVENTOUT)  [also labelled PK5]
LCD_B7 / PK6: RP6.4 U2.C7(PK6/LCD_B7/EVENTOUT)  [also labelled PK6]
LCD_BL / PH6: R30.2 U2.T11(PH6/TIM12_CH1/I2C2_SMBA/SPI5_SCK/ETH_MII_RXD2/FMC_SDNE1/DCMI_D8/EVENTOUT)  [also labelled PH6]
LCD_CLK / PI14: RP7.1 U2.H3(PI14/LCD_CLK/EVENTOUT)  [also labelled PI14]
LCD_DE / PK7: RP7.4 U2.D7(PK7/LCD_DE/EVENTOUT)  [also labelled PK7]
LCD_G0 / PJ7: RP3.1 U2.N14(PJ7/TRGIN/TIM8_CH2N/LCD_G0/EVENTOUT)  [also labelled PJ7]
LCD_G1 / PJ8: RP3.2 U2.N13(PJ8/TIM1_CH3N/TIM8_CH1/UART8_TX/LCD_G1/EVENTOUT)  [also labelled PJ8]
LCD_G2 / PJ9: RP3.3 U2.M14(PJ9/TIM1_CH3/TIM8_CH1N/UART8_RX/LCD_G2/EVENTOUT)  [also labelled PJ9]
LCD_G3 / PJ10: RP3.4 U2.L14(PJ10/TIM1_CH2N/TIM8_CH2/SPI5_MOSI/LCD_G3/EVENTOUT)  [also labelled PJ10]
LCD_G4 / PJ11: RP4.1 U2.K14(PJ11/TIM1_CH2/TIM8_CH2N/SPI5_MISO/LCD_G4/EVENTOUT)  [also labelled PJ11]
LCD_G5 / PK0: RP4.2 U2.J14(PK0/TIM1_CH1N/TIM8_CH3/SPI5_SCK/LCD_G5/EVENTOUT)  [also labelled PK0]
LCD_G6 / PK1: RP4.3 U2.J15(PK1/TIM1_CH1/TIM8_CH3N/SPI5_NSS/LCD_G6/EVENTOUT)  [also labelled PK1]
LCD_G7 / PK2: RP4.4 U2.H17(PK2/TIM1_BKIN/TIM8_BKIN/TIM8_BKIN_COMP12/TIM1_BKIN_COMP12/LCD_G7/EVENTOUT)  [also labelled PK2]
LCD_HS / PI12: RP7.2 U2.H1(PI12/LCD_HSYNC/EVENTOUT)  [also labelled PI12]
LCD_R0 / PI15: RP1.1 U2.P5(PI15/LCD_G2/LCD_R0/EVENTOUT)  [also labelled PI15]
LCD_R1 / PJ0: RP1.2 U2.N6(PJ0/LCD_R7/LCD_R1/EVENTOUT)  [also labelled PJ0]
LCD_R2 / PJ1: RP1.3 U2.P6(PJ1/LCD_R2/EVENTOUT)  [also labelled PJ1]
LCD_R3 / PJ2: RP1.4 U2.T6(PJ2/LCD_R3/EVENTOUT)  [also labelled PJ2]
LCD_R4 / PJ3: RP2.1 U2.U6(PJ3/LCD_R4/EVENTOUT)  [also labelled PJ3]
LCD_R5 / PJ4: RP2.2 U2.U7(PJ4/LCD_R5/EVENTOUT)  [also labelled PJ4]
LCD_R6 / PJ5: RP2.3 U2.R12(PJ5/LCD_R6/EVENTOUT)  [also labelled PJ5]
LCD_R7 / PJ6: RP2.4 U2.N15(PJ6/TIM8_CH2/LCD_R7/EVENTOUT)  [also labelled PJ6]
LCD_VS / PI13: RP7.3 U2.H2(PI13/LCD_VSYNC/EVENTOUT)  [also labelled PI13]
LED / PC13: LED5.2(K) U2.E3(PC13/EVENTOUT)
LED+: 7.2 D1.2(K) U10.39
LED-: R29.1 R33.1 U10.40
OS_25M_IN: C39.2 U2.J2(PH0-OSC_IN(PH0)/EVENTOUT) X2.3
OS_25M_OUT: C38.2 U2.J1(PH1-OSC_OUT(PH1)/EVENTOUT) X2.1
OS_32K_IN: C40.1 U2.C2(PC14-OSC32_IN/EVENTOUT) X3.2
OS_32K_OUT: C41.1 U2.C1(PC15-OSC32_OUT/EVENTOUT) X3.1
PA9: JP1.8 R10.2 U2.D15(PA9/TIM1_CH2/HRTIM_CHC1/LPUART1_TX/I2C3_SMBA/SPI2_SCK/I2S2_CK/USART1_TX/FDCAN1_RXFD_MODE/DCMI_D0/LCD_R5/EVENTOUT)  [also labelled USART1-TX / PA9]
PA10: JP1.6 R9.2 U2.D14(PA10/TIM1_CH3/HRTIM_CHC2/LPUART1_RX/USART1_RX/FDCAN1_TXFD_MODE/OTG_FS_ID/MDIOS_MDIO/LCD_B4/DCMI_D1/LCD_B1/EVENTOUT)  [also labelled USART1-RX / PA10]
PA11: U2.E17(PA11/TIM1_CH4/HRTIM_CHD1/LPUART1_CTS/SPI2_NSS/I2S2_WS/UART4_RX/USART1_CTS/USART1_NSS/FDCAN1_RX/OTG_FS_DM/LCD_R4/EVENTOUT) U5.A7(DN1) U5.B7(DN2)  [also labelled USB_N]
PA12: U2.E16(PA12/TIM1_ETR/HRTIM_CHD2/LPUART1_RTS/LPUART1_DE/SPI2_SCK/I2S2_CK/UART4_TX/USART1_RTS/USART1_DE/SAI2_FS_B/FDCAN1_TX/OTG_FS_DP/LCD_R5/EVENTOUT) U5.A6(DP1) U5.B6(DP2)  [also labelled USB_P]
PB13: R24.2 SW1.2 U2.U14(PB13/TIM1_CH1N/LPTIM2_OUT/SPI2_SCK/I2S2_CK/DFSDM1_CKIN1/USART3_CTS/USART3_NSS/FDCAN2_TX/OTG_HS_ULPI_D6/ETH_MII_TXD1/ETH_RMII_TXD1/UART5_TX/EVENTOUT)
PC8: P1.7(DATA_0) R20.2 U2.E13(PC8/TRACED1/HRTIM_CHB1/TIM3_CH3/TIM8_CH3/USART6_CK/UART5_RTS/UART5_DE/FMC_NE2/FMC_NCE/SWPMI_RX/SDMMC1_D0/DCMI_D2/EVENTOUT)  [also labelled SDMMC1_D0 / PC8]
PC9: P1.8(DATA_1) R19.2 U2.E14(PC9/MCO2/TIM3_CH4/TIM8_CH4/I2C3_SDA/I2S_CKIN/UART5_CTS/QUADSPI_BK1_IO0/LCD_G3/SWPMI_SUSPEND/SDMMC1_D1/DCMI_D3/LCD_B2/EVENTOUT)  [also labelled SDMMC1_D1 / PC9]
PC10: P1.1(DATA_2) R23.2 U2.A13(PC10/HRTIM_EEV1/DFSDM1_CKIN5/SPI3_SCK/I2S3_CK/USART3_TX/UART4_TX/QUADSPI_BK1_IO1/SDMMC1_D2/DCMI_D8/LCD_R2/EVENTOUT)  [also labelled SDMMC1_D2 / PC10]
PC11: P1.2(DATA_3) R22.2 U2.B13(PC11/HRTIM_FLT2/DFSDM1_DATIN5/SPI3_MISO/I2S3_SDI/USART3_RX/UART4_RX/QUADSPI_BK2_NCS/SDMMC1_D3/DCMI_D4/EVENTOUT)  [also labelled SDMMC1_D3 / PC11]
PC12: P1.5(CLK) U2.C12(PC12/TRACED3/HRTIM_EEV2/SPI3_MOSI/I2S3_SDO/USART3_CK/UART5_TX/SDMMC1_CK/DCMI_D9/EVENTOUT)  [also labelled SDMMC1_CLK / PC12]
PD2: P1.3(CMD) R21.2 U2.D12(PD2/TRACED2/TIM3_ETR/UART5_RX/SDMMC1_CMD/DCMI_D11/EVENTOUT)  [also labelled SDMMC1_CMD / PD2]
PI8: R47.1 U2.E4(PI8/EVENTOUT)  [also labelled TOUCH_RST / PI8]
PI11: R46.1 U2.F4(PI11/LCD_G6/OTG_HS_ULPI_DIR/EVENTOUT)  [also labelled TOUCH_INT / PI11]
QSPI_BK1_IO0 / PF8: U2.K4(PF8/TIM16_CH1N/SPI5_MISO/SAI1_SCK_B/UART7_RTS/UART7_DE/SAI4_SCK_B/TIM13_CH1/QUADSPI_BK1_IO0/EVENTOUT) U6.5(DI(IO0))
QSPI_BK1_IO1 / PF9: U2.L4(PF9/TIM17_CH1N/SPI5_MOSI/SAI1_FS_B/UART7_CTS/SAI4_FS_B/TIM14_CH1/QUADSPI_BK1_IO1/EVENTOUT) U6.2(DO(IO1))
QSPI_BK1_IO2 / PF7: U2.K3(PF7/TIM17_CH1/SPI5_SCK/SAI1_MCLK_B/UART7_TX/SAI4_MCLK_B/QUADSPI_BK1_IO2/EVENTOUT) U6.3(WP#(IO2))
QSPI_BK1_IO3 / PF6: U2.K2(PF6/TIM16_CH1/SPI5_NSS/SAI1_SD_B/UART7_RX/SAI4_SD_B/QUADSPI_BK1_IO3/EVENTOUT) U6.7(HOLDor#/RESET#(IO3))
QSPI_BK1_NCS / PG6: U2.G15(PG6/TIM17_BKIN/HRTIM_CHE1/QUADSPI_BK1_NCS/FMC_NE3/DCMI_D12/LCD_R7/EVENTOUT) U6.1(CS#)
QSPI_CLK / PF10: U2.L3(PF10/TIM16_BKIN/SAI1_D3/QUADSPI_CLK/SAI4_D3/DCMI_D11/LCD_DE/EVENTOUT) U6.6(CLK)
RST: C36.1 JP1.10 Q1.3(C) R11.2 R25.1 SW3.1 U2.K1(NRST)
SWCLK / PA14: JP1.4 R8.2 U2.B14(PA14/JTCK-SWCLK/EVENTOUT)
SWDIO / PA13: JP1.2 R7.2 U2.C15(PA13/JTMS-SWDIO/EVENTOUT)
VBAT: C47.1 D5.3 U2.B1(VBAT)
VBAT-EXT: D5.1 JP2.4
VDDA: C43.2 C44.2 FB4.2 R36.1 U2.L1(VDDA)
VREF: C45.2 C46.2 JP2.2 R36.2 U2.M1(VREF+)
Net1_2: 1.2 2.2 FB1.1 U7.3(VIN)
Net8_1: 8.1(SW) D1.1(A) L1.1
Net8_2: 8.2(GND) R28.2
Net8_3: 8.3(FB) R29.2
Net8_4: 8.4(~{SHTDN!}) 13.2 R30.1 R32.1
Net11_2: 11.2 12.2 FB2.1 U8.3(VIN)
Net16_2: 16.2 17.2 FB3.1 U9.3(VIN)
Net21_2: 21.2 22.2 FB6.2 IC1.11(DOVDD)
Net24_2: 24.2 IC1.6(RESET) R38.2
Net25_2: 25.2 IC1.5(SCL) R40.1 R42.1
Net26_2: 26.2 IC1.3(SDA) R41.1 R43.1
Net27_2: 27.2 FB7.2 X4.4(VCC)
Net28_2: 28.2 JP3.2 R45.2 R48.1
Net29_2: 29.2 JP3.1 R44.2 R58.1
NetC1_2: C1.2 U2.A7(VCAP)
NetC2_2: C2.2 U2.D17(VCAP)
NetC3_2: C3.2 U2.U11(VCAP)
NetC4_1: C4.1 U1.5(PD0-OSC_IN) X1.1
NetC5_1: C5.1 U1.6(PD1) X1.2
NetC37_1: C37.1 Q1.1(B) R26.2 R27.2
NetC42_1: C42.1 D3.2(K) Q2.1(B)
NetC49_1: C49.1 R59.2 R62.1 U11.2(FB3)
NetC50_1: C50.1 R50.1 R61.2 U11.3(FB2)
NetD3_1: D3.1(A) R26.1 SW2.2
NetIC1_13: IC1.13(XVCLK) X4.3(OUT)
NetJP1_1: JP1.1 R7.1 R13.2
NetJP1_3: JP1.3 R8.1 R16.2
NetJP3_3: JP3.3 R46.2
NetJP3_6: JP3.6 R47.2
NetL2_2: L2.2 U11.20(SW3)
NetL3_2: L3.2 U11.6(SW2)
NetLED1_1: LED1.1(A) R2.2
NetLED2_1: LED2.1(A) R6.2
NetLED4_1: LED4.1(A) R35.2
NetLED5_1: LED5.1(A) R37.2
NetQ2_3: Q2.3(C) R31.1
NetR1_2: R1.2 U2.E7(PDR_ON)
NetR14_2: R14.2 U4.A7(DN1) U4.B7(DN2)
NetR17_2: R17.2 U4.A6(DP1) U4.B6(DP2)
NetR49_1: R49.1 X4.1(EN/NC)
NetRP1_5: RP1.5 U10.33
NetRP1_6: RP1.6 U10.34
NetRP1_7: RP1.7 U10.35
NetRP1_8: RP1.8 U10.36
NetRP2_5: RP2.5 U10.29
NetRP2_6: RP2.6 U10.30
NetRP2_7: RP2.7 U10.31
NetRP2_8: RP2.8 U10.32
NetRP3_5: RP3.5 U10.25
NetRP3_6: RP3.6 U10.26
NetRP3_7: RP3.7 U10.27
NetRP3_8: RP3.8 U10.28
NetRP4_5: RP4.5 U10.21
NetRP4_6: RP4.6 U10.22
NetRP4_7: RP4.7 U10.23
NetRP4_8: RP4.8 U10.24
NetRP5_5: RP5.5 U10.17
NetRP5_6: RP5.6 U10.18
NetRP5_7: RP5.7 U10.19
NetRP5_8: RP5.8 U10.20
NetRP6_5: RP6.5 U10.13
NetRP6_6: RP6.6 U10.14
NetRP6_7: RP6.7 U10.15
NetRP6_8: RP6.8 U10.16
NetRP7_5: RP7.5 U10.7
NetRP7_6: RP7.6 U10.8
NetRP7_7: RP7.7 U10.9
NetRP7_8: RP7.8 U10.11

Not connected (* = marked no-connect by the designer): U1 2(PC13-TAMPER-RTC)* 3(PC14-OSC32_IN)* 4(PC15-OSC32_OUT)* 10(PA0-WKUP)* 11(PA1)* 13(PA3)* 15(PA5)* 17(PA7)* 18(PB0)* 19(PB1)* 20(PB2)* 21(PB10)* 22(PB11)* 26(PB13)* 27(PB14)* 28(PB15)* 29(PA8)* 34(PA13)* 37(PA14)* 38(PA15)* 39(PB3)* 40(PB4)* 41(PB5)* 42(PB6)* 43(PB7)* 46(PB9)*; U2 A5(PB5/TIM17_BKIN/TIM3_CH2/HRTIM_EEV7/I2C1_SMBA/SPI1_MOSI/I2S1_SDO/I2C4_SMBA/SPI3_MOSI/I2S3_SDO/SPI6_MOSI/FDCAN2_RX/OTG_HS_ULPI_D7/ETH_PPS_OUT/FMC_SDCKE1/DCMI_D10/UART5_RX/EVENTOUT)* A11(PD5/HRTIM_EEV3/USART2_TX/FDCAN1_TXFD_MODE/FMC_NWE/EVENTOUT)* A12(PD4/HRTIM_FLT3/SAI3_FS_A/USART2_RTS/USART2_DE/FDCAN1_RXFD_MODE/FMC_NOE/EVENTOUT)* A14(PA15/JTDI/TIM2_CH1/TIM2_ETR/HRTIM_FLT1/CEC/SPI1_NSS/I2S1_WS/SPI3_NSS/I2S3_WS/SPI6_NSS/UART4_RTS/UART4_DE/UART7_TX/EVENTOUT)* B5(PB6/TIM16_CH1N/TIM4_CH1/HRTIM_EEV8/I2C1_SCL/CEC/I2C4_SCL/USART1_TX/LPUART1_TX/FDCAN2_TX/QUADSPI_BK1_NCS/DFSDM1_DATIN5/FMC_SDNE1/DCMI_D5/UART5_TX/EVENTOUT)* B7(PB4/NJTRST/TIM16_BKIN/TIM3_CH1/HRTIM_EEV6/SPI1_MISO/I2S1_SDI/SPI3_MISO/I2S3_SDI/SPI2_NSS/I2S2_WS/SPI6_MISO/SDMMC2_D3/UART7_TX/EVENTOUT)* B11(PD6/SAI1_D1/DFSDM1_CKIN4/DFSDM1_DATIN1/SPI3_MOSI/I2S3_SDO/SAI1_SD_A/USART2_RX/SAI4_SD_A/FDCAN2_RXFD_MODE/SAI4_D1/SDMMC2_CK/FMC_NWAIT/DCMI_D10/LCD_B2/EVENTOUT)* C3(PE2/TRACECLK/SAI1_CK1/SPI4_SCK/SAI1_MCLK_A/SAI4_MCLK_A/QUADSPI_BK1_IO2/SAI4_CK1/ETH_MII_TXD3/FMC_A23/EVENTOUT)* C5(PB7/TIM17_CH1N/TIM4_CH2/HRTIM_EEV9/I2C1_SDA/I2C4_SDA/USART1_RX/LPUART1_RX/FDCAN2_TXFD_MODE/DFSDM1_CKIN5/FMC_NL/DCMI_VSYNC/EVENTOUT)* C6(PB3/JTDO/TRACESWO/TIM2_CH2/HRTIM_FLT4/SPI1_SCK/I2S1_CK/SPI3_SCK/I2S3_CK/SPI6_SCK/SDMMC2_D2/CRS_SYNC/UART7_RX/EVENTOUT)* C9(PG12/LPTIM1_IN1/HRTIM_EEV5/SPI6_MISO/USART6_RTS/USART6_DE/SPDIFRX1_IN2/LCD_B4/ETH_MII_TXD1/ETH_RMII_TXD1/FMC_NE4/LCD_B1/EVENTOUT)* C11(PD7/DFSDM1_DATIN4/SPI1_MOSI/I2S1_SDO/DFSDM1_CKIN1/USART2_CK/SPDIFRX1_IN1/SDMMC2_CMD/FMC_NE1/EVENTOUT)* D3(PE3/TRACED0/TIM15_BKIN/SAI1_SD_B/SAI4_SD_B/FMC_A19/EVENTOUT)* D4(PB9/TIM17_CH1/TIM4_CH4/DFSDM1_DATIN7/I2C1_SDA/SPI2_NSS/I2S2_WS/I2C4_SDA/SDMMC1_CDIR/UART4_TX/FDCAN1_TX/SDMMC2_D5/I2C4_SMBA/SDMMC1_D5/DCMI_D7/LCD_B7/EVENTOUT)* D5(PB8/TIM16_CH1/TIM4_CH3/DFSDM1_CKIN7/I2C1_SCL/I2C4_SCL/SDMMC1_CKIN/UART4_RX/FDCAN1_RX/SDMMC2_D4/ETH_MII_TXD3/SDMMC1_D4/DCMI_D6/LCD_B6/EVENTOUT)* D8(PG14/TRACED1/LPTIM1_ETR/SPI6_MOSI/USART6_TX/QUADSPI_BK2_IO3/ETH_MII_TXD1/ETH_RMII_TXD1/FMC_A25/LCD_B0/EVENTOUT)* D9(PG13/TRACED0/LPTIM1_OUT/HRTIM_EEV10/SPI6_SCK/USART6_CTS/USART6_NSS/ETH_MII_TXD0/ETH_RMII_TXD0/FMC_A24/LCD_R0/EVENTOUT)* E1(NC)* E15(PA8/MCO1/TIM1_CH1/HRTIM_CHB2/TIM8_BKIN2/I2C3_SCL/USART1_CK/OTG_FS_SOF/UART7_RX/TIM8_BKIN2_COMP12/LCD_B3/LCD_R6/EVENTOUT)* F1(NC1)* G2(NC2)* K16(NC)* K17(NC)* L16(NC)* L17(NC)* M2(PC1/TRACED0/SAI1_D1/DFSDM1_DATIN0/DFSDM1_CKIN4/SPI2_MOSI/I2S2_SDO/SAI1_SD_A/SAI4_SD_A/SDMMC2_CK/SAI4_D1/ETH_MDC/MDIOS_MDC/EVENTOUT)* M3(PC2/CDSLEEP/DFSDM1_CKIN1/SPI2_MISO/I2S2_SDI/DFSDM1_CKOUT/OTG_HS_ULPI_DIR/ETH_MII_TXD2/FMC_SDNE0/EVENTOUT)* M4(PC3/CSLEEP/DFSDM1_DATIN1/SPI2_MOSI/I2S2_SDO/OTG_HS_ULPI_NXT/ETH_MII_TX_CLK/FMC_SDCKE0/EVENTOUT)* M16(NC)* M17(NC)* N3(PA2/TIM2_CH3/TIM5_CH3/LPTIM4_OUT/TIM15_CH1/USART2_TX/SAI2_SCK_B/ETH_MDIO/MDIOS_MDIO/LCD_R1/EVENTOUT)* N4(PA1/TIM2_CH2/TIM5_CH2/LPTIM3_OUT/TIM15_CH1N/USART2_RTS/USART2_DE/UART4_RX/QUADSPI_BK1_IO3/SAI2_MCLK_B/ETH_MII_RX_CLK/ETH_RMII_REF_CLK/LCD_R2/EVENTOUT)* N5(PA0/TIM2_CH1/TIM2_ETR/TIM5_CH1/TIM8_ETR/TIM15_BKIN/USART2_CTS/USART2_NSS/UART4_TX/SDMMC2_CMD/SAI2_SD_B/ETH_MII_CRS/EVENTOUT)* N17(NC)* P11(PB10/TIM2_CH3/HRTIM_SCOUT/LPTIM2_IN1/I2C2_SCL/SPI2_SCK/I2S2_CK/DFSDM1_DATIN7/USART3_TX/QUADSPI_BK1_NCS/OTG_HS_ULPI_D3/ETH_MII_RX_ER/LCD_G4/EVENTOUT)* P12(PB11/TIM2_CH4/HRTIM_SCIN/LPTIM2_ETR/I2C2_SDA/DFSDM1_CKIN7/USART3_RX/OTG_HS_ULPI_D4/ETH_MII_TX_EN/ETH_RMII_TX_EN/LCD_G5/EVENTOUT)* R1(PC2_C/CDSLEEP/DFSDM1_CKIN1/SPI2_MISO/I2S2_SDI/DFSDM1_CKOUT/OTG_HS_ULPI_DIR/ETH_MII_TXD2/FMC_SDNE0/EVENTOUT)* R2(PC3_C/CSLEEP/DFSDM1_DATIN1/SPI2_MOSI/I2S2_SDO/OTG_HS_ULPI_NXT/ETH_MII_TX_CLK/FMC_SDCKE0/EVENTOUT)* R5(PA7/TIM1_CH1N/TIM3_CH2/TIM8_CH1N/SPI1_MOSI/I2S1_SDO/SPI6_MOSI/TIM14_CH1/ETH_MII_RX_DV/ETH_RMII_CRS_DV/FMC_SDNWE/EVENTOUT)* R6(PB2/RTC_OUT/SAI1_D1/DFSDM1_CKIN1/SAI1_SD_A/SPI3_MOSI/I2S3_SDO/SAI4_SD_A/QUADSPI_CLK/SAI4_D1/EVENTOUT)* R15(PD11/LPTIM2_IN2/I2C4_SMBA/USART3_CTS/USART3_NSS/QUADSPI_BK1_IO0/SAI2_SD_A/FMC_A16/EVENTOUT)* R16(PD12/LPTIM1_IN1/TIM4_CH1/LPTIM2_IN1/I2C4_SCL/USART3_RTS/USART3_DE/QUADSPI_BK1_IO1/SAI2_FS_A/FMC_A17/EVENTOUT)* R17(PD13/LPTIM1_OUT/TIM4_CH2/I2C4_SDA/QUADSPI_BK1_IO3/SAI2_SCK_A/FMC_A18/EVENTOUT)* T1(PA0_C/TIM2_CH1/TIM2_ETR/TIM5_CH1/TIM8_ETR/TIM15_BKIN/USART2_CTS/USART2_NSS/UART4_TX/SDMMC2_CMD/SAI2_SD_B/ETH_MII_CRS/EVENTOUT)* T2(PA1_C/TIM2_CH2/TIM5_CH2/LPTIM3_OUT/TIM15_CH1N/USART2_RTS/USART2_DE/UART4_RX/QUADSPI_BK1_IO3/SAI2_MCLK_B/ETH_MII_RX_CLK/ETH_RMII_REF_CLK/LCD_R2/EVENTOUT)* T3(PA5/D2PWREN/TIM2_CH1/TIM2_ETR/TIM8_CH1N/SPI1_SCK/I2S1_CK/SPI6_SCK/OTG_HS_ULPI_CK/LCD_R4/EVENTOUT)* T4(PC4/DFSDM1_CKIN2/I2S1_MCK/SPDIFRX1_IN3/ETH_MII_RXD0/ETH_RMII_RXD0/FMC_SDNE0/EVENTOUT)* T5(PB1/TIM1_CH3N/TIM3_CH4/TIM8_CH3N/DFSDM1_DATIN1/LCD_R6/OTG_HS_ULPI_D2/ETH_MII_RXD3/LCD_G0/EVENTOUT)* T14(PB12/TIM1_BKIN/I2C2_SMBA/SPI2_NSS/I2S2_WS/DFSDM1_DATIN1/USART3_CK/FDCAN2_RX/OTG_HS_ULPI_D5/ETH_MII_TXD0/ETH_RMII_TXD0/OTG_HS_ID/TIM1_BKIN_COMP12/UART5_RX/EVENTOUT)* T15(PB15/RTC_REFIN/TIM1_CH3N/TIM12_CH2/TIM8_CH3N/USART1_RX/SPI2_MOSI/I2S2_SDO/DFSDM1_CKIN2/UART4_CTS/SDMMC2_D1/OTG_HS_DP/EVENTOUT)* U2(PA3/TIM2_CH4/TIM5_CH4/LPTIM5_OUT/TIM15_CH2/USART2_RX/LCD_B2/OTG_HS_ULPI_D0/ETH_MII_COL/LCD_B5/EVENTOUT)* U4(PC5/SAI1_D3/DFSDM1_DATIN2/SPDIFRX1_IN4/SAI4_D3/ETH_MII_RXD1/ETH_RMII_RXD1/FMC_SDCKE0/COMP1_OUT/EVENTOUT)* U5(PB0/TIM1_CH2N/TIM3_CH3/TIM8_CH2N/DFSDM1_CKOUT/UART4_CTS/LCD_R3/OTG_HS_ULPI_D1/ETH_MII_RXD2/LCD_G1/EVENTOUT)* U13(PH7/I2C3_SCL/SPI5_MISO/ETH_MII_RXD3/FMC_SDCKE1/DCMI_D9/EVENTOUT)* U15(PB14/TIM1_CH2N/TIM12_CH1/TIM8_CH2N/USART1_TX/SPI2_MISO/I2S2_SDI/DFSDM1_DATIN2/USART3_RTS/USART3_DE/UART4_RTS/UART4_DE/SDMMC2_D0/OTG_HS_DM/EVENTOUT)*; U3 K2(NU)*; U4 A5(CC1)* A8(SBU1)* B5(CC2)* B8(SBU2)*; U5 A5(CC1)* A8(SBU1)* B5(CC2)* B8(SBU2)*; U10 1* 2* 3* 4* 6*; U11 1(NC)* 4(NC)* 5(NC)* 9(EN1)* 10(VIN1)* 11(SW1)* 12(NC)* 13(NC)* 14(FB1)* 15(NC)* 16(NC)* 17(NC)*

### Notes on the sheet
- DAP-LINK
- SDRAM
- USB
- FLASH
- SD-CARD
- (near FB1) 磁珠/500Ω ±25% @100MHz 150MA
- (near FB2) 磁珠/500Ω ±25% @100MHz 150MA
- (near FB3) 磁珠/500Ω ±25% @100MHz 150MA
- 磁珠/120Ω ±25% @100MHz 200MA
- 晶振
- 复位
- OV5640电源
- LCD电源
- 磁珠/500Ω ±25% @100MHz 150MA
- 串接电阻值120欧
- LED
- (near U10) LCD
- STM32H750
- STM32电源
- OV5640
- (near JP3) 触摸
- (in symbol CE_SMD) +
- (in symbol OV5640) IO口电压; 传感器核心电压; 模拟电压; 对焦电机电压; 500万像素

### Library data of the parts
1-7 9-29 C1-C51 = C: 贴片电容/MLCC电容
8 = CAT4139: LED Driver IC 1 Output DC DC Regulator Step-Up (Boost) Analog, PWM Dimming 750mA (Switch) TSOT-23-5
D1 D2 = SS14: 肖特基二极管
D3 D4 = 1N4007: 整流二极管
D5 = BAT54C: 两路肖特基二极管
E1-E3 = CE_SMD: 贴片电解电容
FB1-FB7 = FB: 贴片磁珠
JP1 = Header 5X2: 5*2P接插件
JP2 = Header 3X2: 3*2P接插件
JP3 = Header 6: 6P连接器
L1-L3 = L: 贴片小功率电感
LED1-LED5 = LED: 贴片LED
P1 = Micro SD_SD: 自弹式TF卡座
Q1 Q2 = 8050-SMD: 高频放大-NPN型
R1-R62 = R: 贴片电阻
RP1-RP7 = RES_4P
SW1-SW3 = SW 3x6: 3x6轻触开关
U1 = STM32F103C8T6: STM32 ARM-based 32-bit MCU Performance Line with 64 kB Flash, 20 kB Internal RAM, -40 to +85癈 Temperature, 48-Pin LQFP, Tray
U2 = STM32H750XBH6: ARMÂ® CortexÂ®-M7 STM32H7 Microcontroller IC 32-Bit 480MHz 128KB (128K x 8) FLASH 240+25-TFBGA (14x14)
U3 = MT48LC4M32B2B5-6A:L: SDRAM Memory IC 128Mb _4M x 32_ Parallel 167MHz 5.4ns 90-VFBGA _8x13_
U9 = LN6206P282MR-G
X1 X3 = XTAL-2P: 2脚无源晶振(谐振器）
X2 = XTAL-4P: 4脚无源晶振(谐振器）
X4 = XTAL-ACT-4P: 4脚有源晶振(振荡器)